# EAGLE schematic SplinktegratedXIAO v15 (EAGLE 9.7.0)
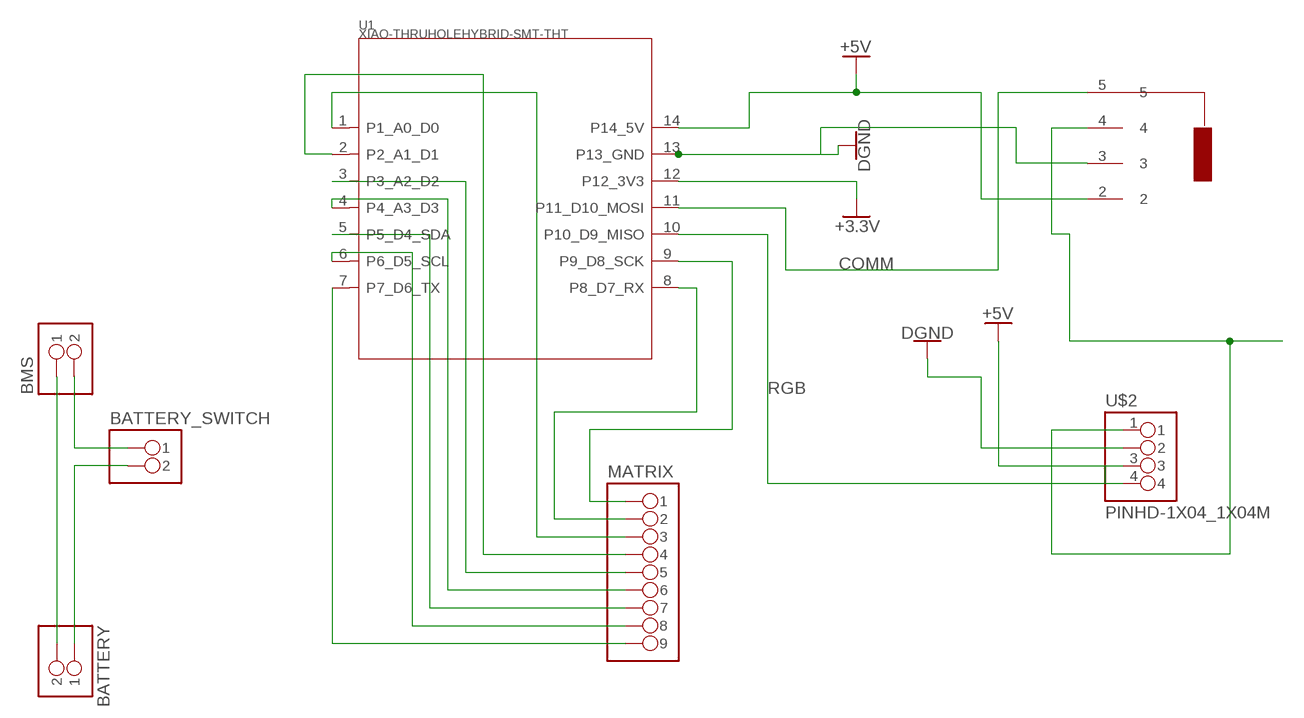
[diagram p0: schematic, sheet 1]

## Parts
BATTERY  PINHD-1X02_1X02M  [1X02]
BATTERY_SWITCH  PINHD-1X02_1X02M  [1X02]
BMS  PINHD-1X02_1X02M  [1X02]
MATRIX  PINHD-1X09_1X09M  [1X09]
U1  XIAO-THRUHOLEHYBRID-SMT-THT  [XIAO-GENERIC-HYBRID-MODULE14P-2.54-21X17.8MM]
U$1  PJ320A  [PJ320A]
U$2  PINHD-1X04_1X04M  [1X04]

## Nets
+3.3V: U1.12(P12_3V3)
+5V: U1.14(P14_5V) U$1.2 U$2.3
COMM: U1.11(P11_D10_MOSI) U$1.5
GND: U1.13(P13_GND) U$1.3 U$2.2 ; supply symbol labelled DGND
N$1: BATTERY.2 BMS.1
N$2: BATTERY_SWITCH.1 BMS.2
N$3: BATTERY.1 BATTERY_SWITCH.2
N$4: MATRIX.1 U1.9(P9_D8_SCK)
N$5: MATRIX.2 U1.8(P8_D7_RX)
N$6: MATRIX.3 U1.1(P1_A0_D0)
N$7: MATRIX.4 U1.2(P2_A1_D1)
N$8: MATRIX.5 U1.3(P3_A2_D2)
N$9: MATRIX.6 U1.4(P4_A3_D3)
N$10: MATRIX.7 U1.5(P5_D4_SDA)
N$11: MATRIX.8 U1.6(P6_D5_SCL)
N$12: MATRIX.9 U1.7(P7_D6_TX)
RGB: U1.10(P10_D9_MISO) U$2.4
RGBCONTINUED: U$1.4 U$2.1

## Library data of the parts
BATTERY BATTERY_SWITCH BMS = Tinkercad:PINHD-1X02
MATRIX = Tinkercad:PINHD-1X09
U1 = Seeed Studio XIAO Series:XIAO-THRUHOLE: Seeed Studio XIAO Series Through-hole Footprint and Symbol Basic through-hole footprint for Seeed XIAO series of boards. The underside surface mount pads are disabled. For through-hole mounting, a pair of 7-pin, 2.54mm pitch headers with 0.64x0.64mm square leads are recommended. The hybrid variant allows the assembler to choose between surface mount and through-hole mounting methods. However, there is a risk of solder leakage and therefore insufficient solder at the joints if soldering using solder paste and stencils, so we advise using this footprint only when the module is intended to be hand soldered. The symbol pin labels are generic. Please refer to the specific board for more information. Seeed Studio XIAO SAMD21 (Seeeduino XIAO) is also available pre-soldered: Seeed Studio XIAO SAMD21 Pre-soldered - Microchip ATSAMD21G18 Arduino Microcontroller with headers Seeed SKU: 102010388 Buy now <https://www.seeedstudio.com/Seeeduino-XIAO-Pre-Soldered-p-4747.html>
U$1 = ChocV2:PJ320A
U$2 = Tinkercad:PINHD-1X04